# EAGLE design BMS Test Board rev1 (EAGLE 9.2.2)
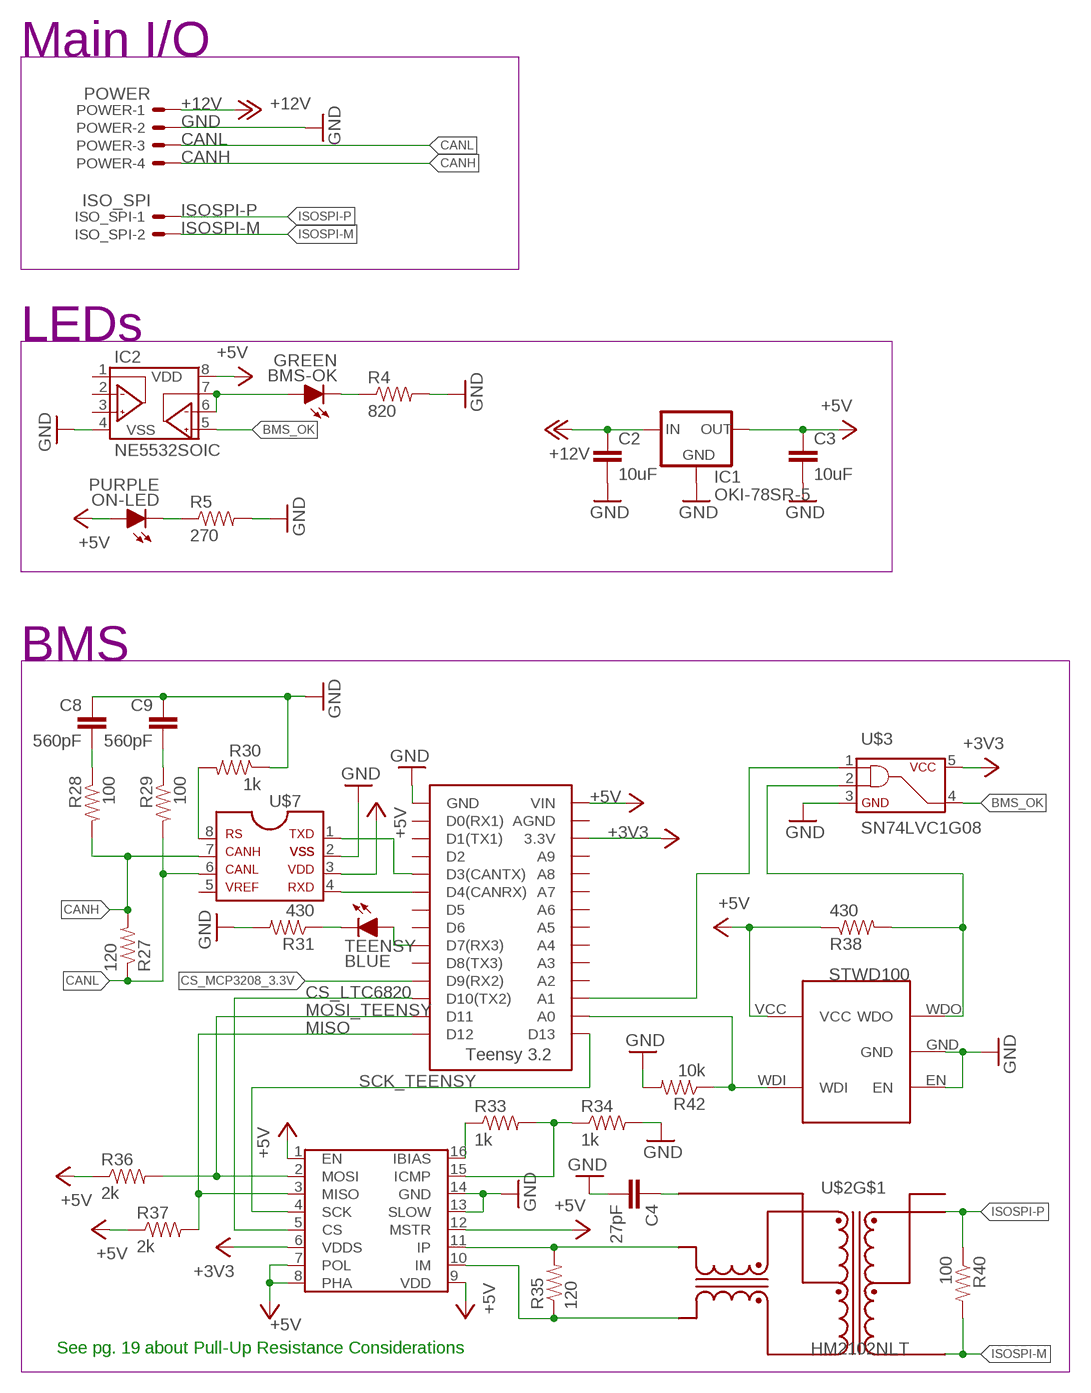
[diagram p0: schematic, sheet 1]

## Parts
BMS-OK  GREEN  LED-0805  [LED-805]
C2  10uF  CAP0805  [0805]
C3  10uF  CAP0805  [0805]
C4  27pF  CAP0805  [0805]
C8  560pF  CAP0805  [0805]
C9  560pF  CAP0805  [0805]
IC1  OKI-78SR-5  [OKI-78SR]
IC2  NE5532SOIC  [SOIC-08]
ISO_SPI  ISO_SPI  CONNECTOR-2NANO-FIT_VERTICAL-2  [NANO-FIT_VERTICAL-2]
ON-LED  PURPLE  LED-0805  [LED-805]
POWER  POWER  CONNECTOR-4NANO-FIT-VERTICAL-4  [NANO-FIT_VERTICAL-4]
R4  820  RESISTOR0805-RES  [0805]
R5  270  RESISTOR0805-RES  [0805]
R27  120  RESISTOR0805-RES  [0805]
R28  100  RESISTOR0805-RES  [0805]
R29  100  RESISTOR0805-RES  [0805]
R30  1k  RESISTOR0805-RES  [0805]
R31  430  RESISTOR0805-RES  [0805]
R33  1k  RESISTOR0805-RES  [0805]
R34  1k  RESISTOR0805-RES  [0805]
R35  120  RESISTOR0805-RES  [0805]
R36  2k  RESISTOR0805-RES  [0805]
R37  2k  RESISTOR0805-RES  [0805]
R38  430  RESISTOR0805-RES  [0805]
R40  100  RESISTOR0805-RES  [0805]
R42  10k  RESISTOR0805-RES  [0805]
TEENSY  BLUE  LED-0805  [LED-805]
U$2  HM2102NLT  [HM2102NLT]
U$3  SN74LVC1G08  [SOT-23-5]
U$7  MCP2551  [SOIC-08]
U$8  LTC6820  [MSOP-16]
U$9  TEENSY_3.2_SIMPLE  [TEENSY_3.2_SIMPLE]
U$10  STWD100  [SOT23-5]

## Nets
+3V3: U$3.5 U$8.6(VDDS) U$9.3.3V
+5V: C3.1 IC1.3(OUT) IC2.8(VDD) ON-LED.A R36.1 R37.1 R38.1 U$7.3 U$8.1(EN) U$8.7(POL) U$8.8(PHA) U$8.9(VDD) U$8.12(MSTR) U$9.VIN U$10.VCC
+12V: C2.1 IC1.1(IN) POWER.P$1
BMS_OK: IC2.5(VINB+) U$3.4
CANH: POWER.P$4 R27.2 R28.2 U$7.7
CANL: POWER.P$3 R27.1 R29.2 U$7.6
CS_LTC6820: U$8.5(CS) U$9.D10(TX2)
CS_MCP3208_3.3V: U$9.D9(RX2)
GND: C2.2 C3.2 C4.2 C8.1 C9.1 IC1.2(GND) IC2.4(VSS) POWER.P$2 R4.2 R5.2 R30.1 R31.2 R34.2 R42.2 U$3.3 U$7.2 U$8.13(SLOW) U$8.14(GND) U$9.GND U$10.EN U$10.GND
IM: R35.1 U$2.P$10(TD-) U$8.10(IM)
IP: R35.2 U$2.P$12(TD+) U$8.11(IP)
ISOSPI-M [ISO_SPI]: ISO_SPI.P$2 R40.2 U$2.P$3(MX-)
ISOSPI-P [ISO_SPI]: ISO_SPI.P$1 R40.1 U$2.P$1(MX+)
MISO: R37.2 U$8.3(MISO) U$9.D12
MOSI_TEENSY: R36.2 U$8.2(MOSI) U$9.D11
N$3: ON-LED.C R5.1
N$25: U$7.1 U$9.D3(CANTX)
N$26: R30.2 U$7.8
N$27: C8.2 R28.1
N$28: C9.2 R29.1
N$29: R31.1 TEENSY.C
N$31: R33.1 U$8.16(IBIAS)
N$32: R33.2 R34.1 U$8.15(ICMP)
N$35: C4.1 U$2.P$11(TCT)
N$36: U$7.4 U$9.D4(CANRX)
N$37: TEENSY.A U$9.D7(RX3)
N$38: R38.2 U$3.2 U$10.WDO
N$40: U$3.1 U$9.A1
N$43: BMS-OK.A IC2.6(VINB-) IC2.7(VOUTB)
N$44: BMS-OK.C R4.1
N$50: R42.1 U$9.A0 U$10.WDI
SCK_TEENSY: U$8.4(SCK) U$9.D13
Unconnected: IC2.1(VOUTA) IC2.2(VINA-) IC2.3(VINA+) U$2.P$2(MCT) U$2.P$4(MX+) U$2.P$5(MCT) U$2.P$6(MX-) U$2.P$7(TD-) U$2.P$8(TCT) U$2.P$9(TD+) U$7.5 U$9.A2 U$9.A3 U$9.A4 U$9.A5 U$9.A6 U$9.A7 U$9.A8 U$9.A9 U$9.AGND U$9.D0(RX1) U$9.D1(TX1) U$9.D2 U$9.D5 U$9.D6 U$9.D8(TX3)

## Notes on the sheet
- Main I/O
- LEDs
- BMS
- See pg. 19 about Pull-Up Resistance Considerations

## Library data of the parts
BMS-OK ON-LED TEENSY = HyTechDevices:LED: Light Emitting Diode (LED) Source: Dangerous Prototypes Eagle Library <https://github.com/DangerousPrototypes/Eagle_Part_Library>
C2-C4 C8 C9 = HyTechDevices:CAP: Capacitor Standard 0603 ceramic capacitor, and 0.1" leaded capacitor.
IC1 = HyTechDevices:OKI-78SR-5: Murata OKI-78SR 5V 1.5A Non-Isolated Switching Regulator DC/DC - Datasheet <https://power.murata.com/data/power/oki-78sr.pdf>
IC2 = HyTechDevices:NE5532: TI NE5532 Dual Channel Op Amp
ISO_SPI = HyTechDevices:CONNECTOR-2: Mini-Fit Junior connector 2 pole Source: http://www.molex.com
POWER = HyTechDevices:CONNECTOR-4: Mini-Fit Junior connector 4 pole Source: http://www.molex.com
R4 R5 R27-R31 R33-R38 R40 R42 = HyTechDevices:RESISTOR: Resistor Basic schematic elements and footprints for 0603, 1206, and PTH resistors.
U$2 = HyTechDevices:HM2102NLT: 2 Channel SMT Transformer Turns ratio: 1CT: 1CT Isolation Voltage: 4300 VDC Inductance: 150 uH Leakage Inductance: 0.50 uH max DataSheet <https://www.mouser.com/datasheet/2/336/HM2102NL-1218600.pdf>
U$3 = HyTechDevices:SN74LVC1G08: TI SN74LVC1G08 SINGLE 2-INPUT POSITIVE-AND GATE Datasheet <http://www.ti.com/lit/ds/sces556f/sces556f.pdf>
U$7 = HyTechDevices:MCP2551: MCP2551 High-Speed CAN Transceiver Product Webpage <https://www.microchip.com/wwwproducts/en/MCP2551> Datasheet <http://ww1.microchip.com/downloads/en/DeviceDoc/21667f.pdf> This device is outdated It is replaced by MCP2561. Comparison Page <https://www.microchip.com/wwwproducts/ProductCompare/MCP2551/MCP2561> Product Webpage <https://www.microchip.com/wwwproducts/en/MCP2561> Datasheet <http://ww1.microchip.com/downloads/en/DeviceDoc/20005167C.pdf>
U$8 = HyTechDevices:LTC6820: Linear Technology isoSPI Isolated Communications Interface Datasheet <http://cds.linear.com/docs/en/datasheet/6820fb.pdf>
U$9 = HyTechDevices:TEENSY_3.2_SIMPLE: Simple version of the Teensy 3.2 board that only uses the 2 main rows of pins, not the inner pins or the pins opposite the usb port.
U$10 = HyTechDevices:STWD100: STWD100 Watchdog timer

## Net classes
1 TS: clearance 8.5 mm to class 0
2 ISO_SPI: clearance 8.5 mm to class 0, clearance 8.5 mm to class 1

## Board
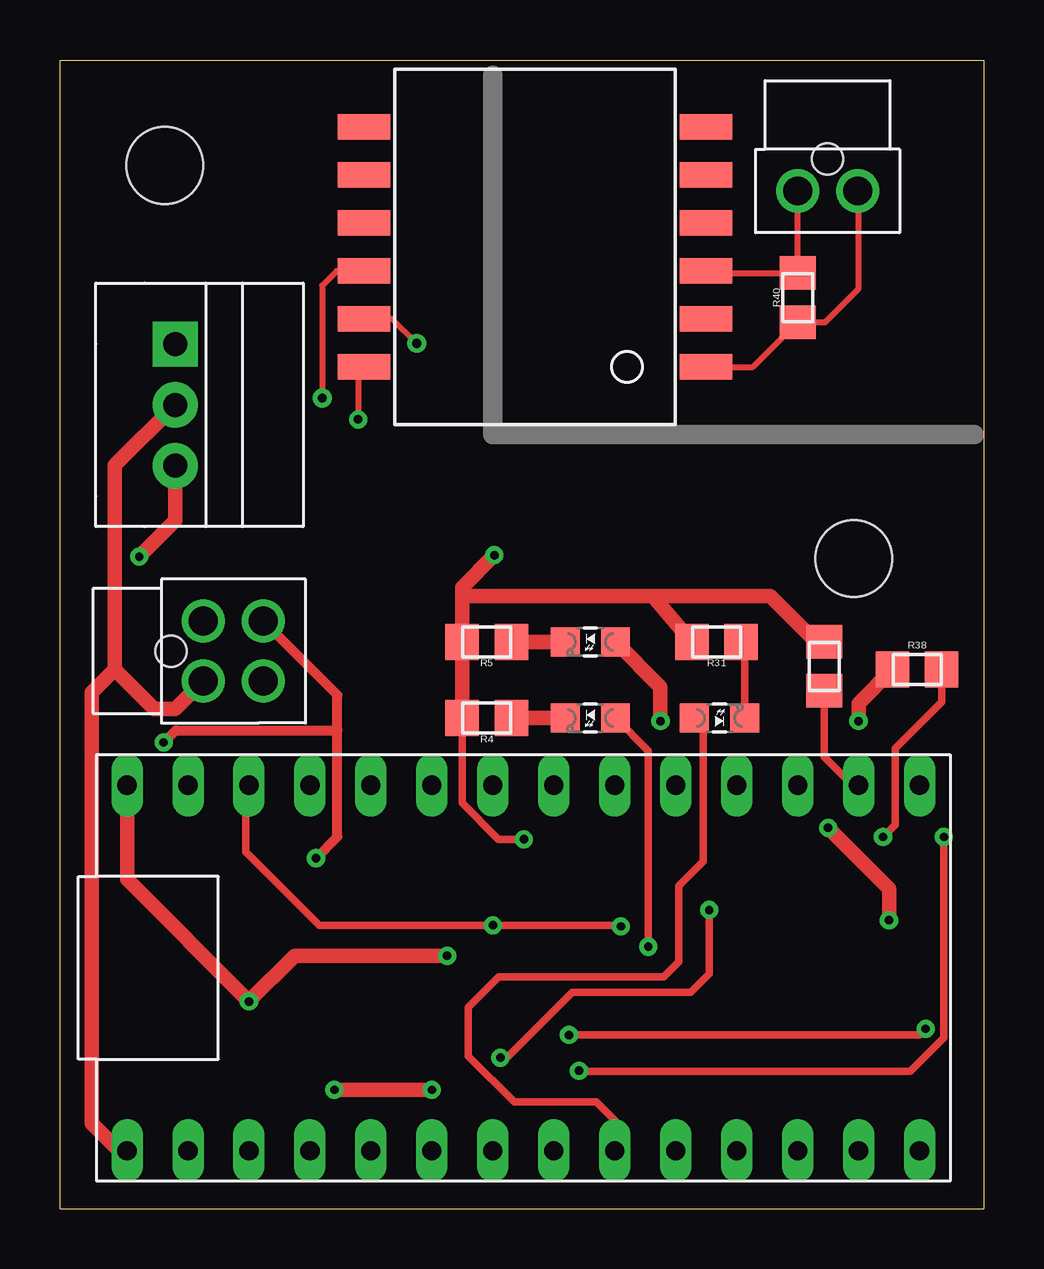
[diagram p1: board, top side]
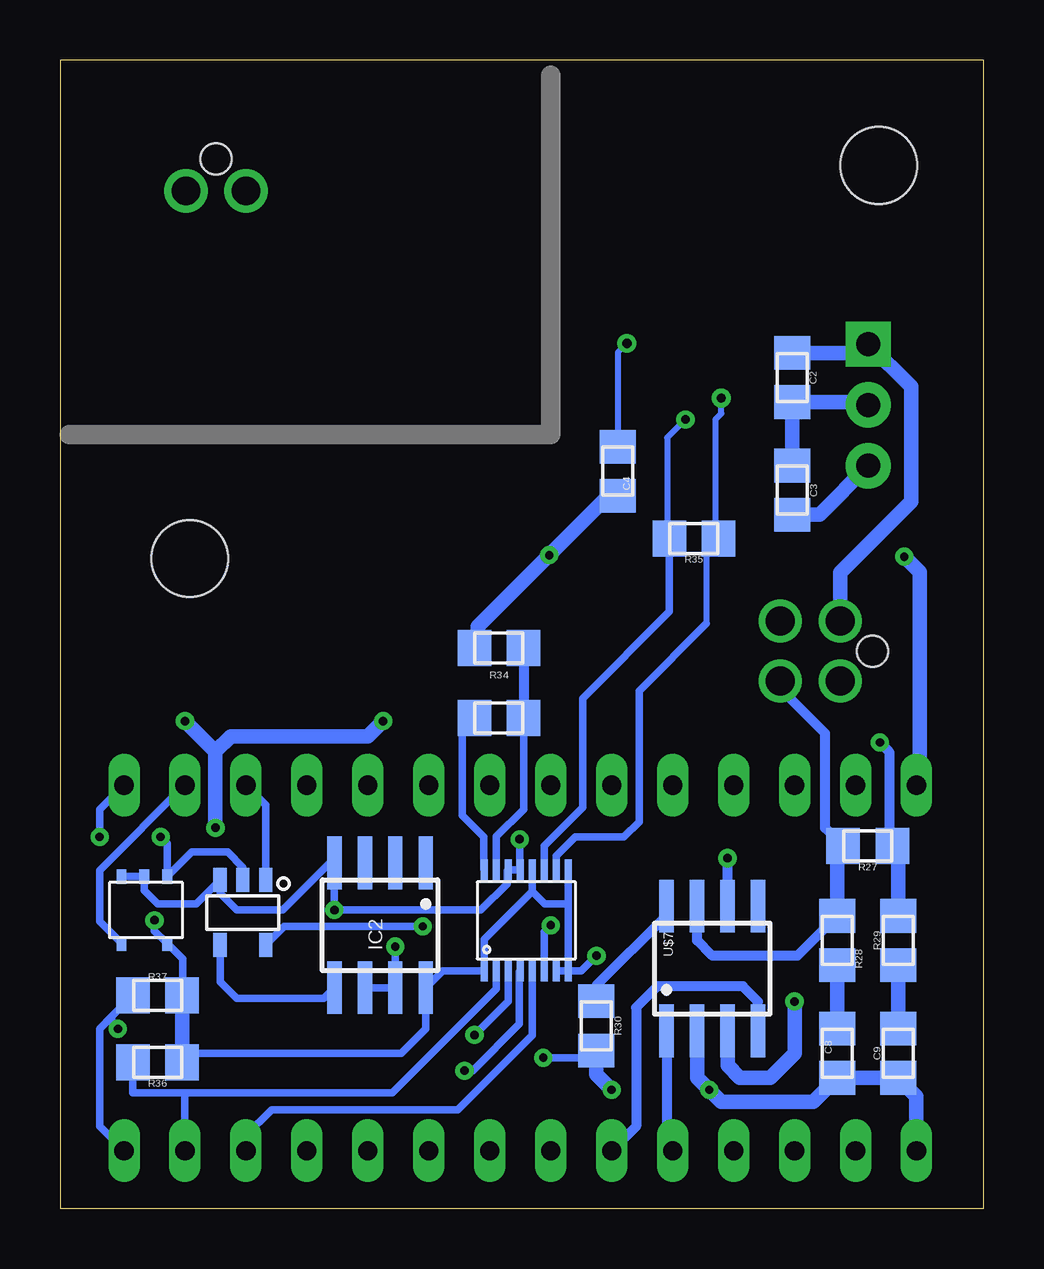
[diagram p2: board, bottom side, seen from below]

Size 38.48 x 47.88 mm. Coordinates in mm from the lower left corner, seen from the top.
Outline: 0,0 38.48,0 38.48,47.88 0,47.88 0,0
Copper layers (1*16): Top 0.035mm / dielectric 1.5mm / Bottom 0.035mm
Design rules "DRC Advanced Circuits": minimum track width 6mil, minimum drill 10mil, track to track 6mil, track to pad 6mil, pad to pad 6mil, via to via 6mil, smd to smd 6mil, copper to edge 40mil, drill to drill 6mil, minimum pad ring 10mil, minimum via ring 8mil, stop-mask expansion 4mil, vias tented up to drill 0mil, thermal gap 10mil
Holes 3.2 mm at 33.07,27.1 4.37,43.48

### Footprints (pad centres in the part's own frame; a part is rotated, then mirrored left to right if it is on the bottom)
LED-805 = smd 1.2 x 1.2: A 0,-1.05; C 0,1.05
0805 = smd 1.4 x 1.5: 1 -1.025,0; 2 1.025,0
OKI-78SR = drill 1 pad 1.88 square: 1 -2.54,0 | drill 1 pad 1.88: 2 0,0; 3 2.54,0
SOIC-08 = smd 0.6 x 2.2: 1 -1.905,-2.6; 2 -0.635,-2.6; 3 0.635,-2.6; 4 1.905,-2.6; 5 1.905,2.6; 6 0.635,2.6; 7 -0.635,2.6; 8 -1.905,2.6
NANO-FIT_VERTICAL-2 = drill 1.2: P$1 -1.25,0; P$2 1.25,0 | hole 1.3: 0,-1.34
NANO-FIT_VERTICAL-4 = drill 1.2: P$1 -1.25,0; P$2 1.25,0; P$3 -1.25,2.5; P$4 1.25,2.5 | hole 1.3: 0,-1.34
HM2102NLT = smd 1.067 x 2.184: P$1 0,0; P$2 2,0; P$3 4,0; P$4 6,0; P$5 8,0; P$6 10,0; P$7 10,14.25; P$8 8,14.25; P$9 6,14.25; P$10 4,14.25; P$11 2,14.25; P$12 0,14.25
SOT-23-5 = smd 1 x 0.55: 1 -1.35,0.95; 2 -1.35,0; 3 -1.35,-0.95; 4 1.35,-0.95; 5 1.35,0.95
MSOP-16 = smd 0.305 x 0.889: 1 -0.1,-0.5; 2 0.4,-0.5; 3 0.9,-0.5; 4 1.4,-0.5; 5 1.9,-0.5; 6 2.4,-0.5; 7 2.9,-0.5; 8 3.4,-0.5; 9 3.4,3.7; 10 2.9,3.7; 11 2.4,3.7; 12 1.9,3.7; 13 1.4,3.7; 14 0.9,3.7; 15 0.4,3.7; 16 -0.1,3.7
TEENSY_3.2_SIMPLE = drill 0.8 long: 3.3V 16.51,29.21; A0 16.51,3.81; A1 16.51,6.35; A2 16.51,8.89; A3 16.51,11.43; A4 16.51,13.97; A5 16.51,16.51; A6 16.51,19.05; A7 16.51,21.59; A8 16.51,24.13; A9 16.51,26.67; AGND 16.51,31.75; D0(RX1) 1.27,31.75; D1(TX1) 1.27,29.21; D2 1.27,26.67; D3(CANTX) 1.27,24.13; D4(CANRX) 1.27,21.59; D5 1.27,19.05; D6 1.27,16.51; D7(RX3) 1.27,13.97; D8(TX3) 1.27,11.43; D9(RX2) 1.27,8.89; D10(TX2) 1.27,6.35; D11 1.27,3.81; D12 1.27,1.27; D13 16.51,1.27; GND 1.27,34.29; VIN 16.51,34.29
SOT23-5 = smd 0.61 x 0.406: EN -2.794,0; GND -2.794,0.94; VCC 0,1.905; WDI 0,0; WDO -2.794,1.905

### Placement (x,y rotation side)
BMS-OK  22.1,20.45 90 top
C2  7.98,34.65 270 bottom
C3  7.98,29.95 90 bottom
C4  15.24,30.73 270 bottom
C8  6.1,6.48 90 bottom
C9  3.56,6.48 90 bottom
IC1  4.8,33.5 270 top
IC2  25.15,11.81 180 bottom
ISO_SPI  31.98,42.42 180 top
ON-LED  22.1,23.62 90 top
POWER  5.97,23.24 270 top
R4  17.78,20.45 180 top
R5  17.78,23.62 180 top
R27  4.83,15.11 180 bottom
R28  6.1,11.18 90 bottom
R29  3.56,11.18 90 bottom
R30  16.13,7.62 90 bottom
R31  27.36,23.62 180 top
R33  20.19,20.45 0 bottom
R34  20.19,23.37 180 bottom
R35  12.06,27.94 180 bottom
R36  34.42,6.1 180 bottom
R37  34.42,8.89 180 bottom
R38  35.71,22.48 0 top
R40  30.73,37.97 90 top
R42  31.85,22.61 90 top
TEENSY  27.48,20.45 270 top
U$2  26.92,35.09 90 top
U$3  30.86,12.34 270 bottom
U$7  11.3,10.01 0 bottom
U$8  20.7,10.41 0 bottom
U$9  37.08,1.14 90 top
U$10  35.92,11.05 270 bottom

### Tracks (layer width: path | path; a pad name or v marks a point on that pad's centre or on a via)
+3V3  (via drill 0.35)
  Top 0.305: U$9.3.3V 7.75,17.53 7.75,14.86 10.79,11.81 v18.03,11.81 23.32,11.81 v23.37,11.76
  Bottom 0.305: U$8.6 18.3,11.54 v18.03,11.81 | U$3.5 29.34,11.56 29.22,11.68 29.14,11.76 v23.37,11.76
+5V  (via drill 0.35)
  Top 0.61: v3.3,27.18 4.8,28.68 IC1.3 | U$9.VIN 2.79,13.72 v7.87,8.64 9.78,10.54 v16.13,10.54 | v25.02,20.32 25.02,21.75 ON-LED.A | R38.1 33.27,21.07 v33.27,20.32 | v32,15.87 34.54,13.33 v34.54,12.02
  Bottom 0.305: v16.13,10.54 16.76,9.91 U$8.8 17.4,9.91 | U$8.7 17.4,9.91 | U$8.9 17.3,12.7 | 17.3,12.7 17.3,10.01 17.4,9.91 | U$8.12 18.8,13.21 | 17.3,12.7 18.29,12.7 18.8,13.21 | 18.8,13.21 20.8,11.21 U$8.1 22.54,9.91 IC2.8 23.24,7.49 24.26,6.48 33.01,6.48 R36.1 | R37.1 33.38,8.91 33.38,10.41 U$10.VCC 34.54,11.58 v34.54,12.02
  Bottom 0.61: C3.1 6.83,28.92 6.83,28.93 IC1.3 | U$9.VIN 2.66,17.79 2.66,26.53 v3.3,27.18 | v7.87,8.64 7.87,6.48 8.89,5.46 10.16,5.46 10.67,5.97 U$7.3 | R37.1 R36.1 | v25.02,20.32 25.65,19.69 31.37,19.69 32,19.05 | 32,19.05 v32,15.87 | v33.27,20.32 32,19.05
+12V
  Bottom 0.61: C2.1 5.17,35.67 IC1.1 3.02,34.27 3.02,29.46 5.97,26.52 POWER.P$1
BMS_OK
  Bottom 0.305: U$3.4 31.81,9.46 31.11,8.76 27.5,8.76 IC2.5
CANH
  Bottom 0.406: R28.2 7.76,10.54 11.3,10.54 11.94,11.18 U$7.7 | R27.2 6.6,15.87 6.6,19.81 8.47,21.68 POWER.P$4
  Bottom 0.61: R28.2 6.1,14.87 R27.2
CANL  (via drill 0.35)
  Top 0.406: v10.67,14.6 11.56,15.49 11.56,19.94 | POWER.P$3 11.56,21.4 11.56,19.94 | v4.32,19.43 4.83,19.94 11.56,19.94
  Bottom 0.406: U$7.6 v10.67,14.6 | R27.1 3.94,15.25 3.94,19.05 v4.32,19.43
  Bottom 0.61: R29.2 3.56,14.87 R27.1
CS_LTC6820
  Bottom 0.305: U$9.D10(TX2) 30.73,3.05 29.67,4.11 21.91,4.11 18.8,7.23 U$8.5
GND  (via drill 0.35)
  Top 0.305: v18.35,6.29 18.61,6.29 21.34,9.02 26.29,9.02 27.05,9.78 v27.05,12.45 | R4.2 16.75,16.9 18.26,15.39 v19.33,15.39
  Top 0.61: IC1.2 2.29,30.99 2.29,22.48 | v11.43,4.95 v15.49,4.95 | 2.29,22.48 3.94,20.83 4.81,20.83 POWER.P$2 | R4.2 R5.2 16.75,25.53 | 16.75,25.53 16.75,25.9 v18.1,27.24 | R31.2 24.7,25.53 | 24.7,25.53 16.75,25.53 | 24.7,25.53 29.59,25.53 31.49,23.63 R42.2 | 2.29,22.48 1.32,21.51 1.32,3.56 2.46,2.41 U$9.GND
  Bottom 0.305: U$10.EN U$10.GND 34.98,13.26 34.42,12.7 32.8,12.7 U$3.3 31.81,13.14 31.11,12.45 29.21,12.45 27.25,14.41 IC2.4 v27.05,12.45 20.94,12.45 19.84,13.54 19.84,14.07 U$8.14 U$8.13 19.33,14.14 v19.33,15.39 | v18.35,6.29 16.43,6.29 R30.1
  Bottom 0.61: C4.2 15.24,29.59 15.75,29.59 v18.1,27.24 21.08,24.26 21.08,23.5 R34.2 | IC1.2 4.92,33.62 C2.2 C3.2 | U$9.GND 2.79,4.69 C9.1 C8.1 7.1,4.44 10.92,4.44 v11.43,4.95 11.94,5.46 U$7.2 | v15.49,4.95 16.13,5.59 R30.1
IM  (via drill 0.38)
  Top 0.254: v10.92,33.78 10.92,38.48 11.53,39.09 U$2.P$10
  Bottom 0.254: v10.92,33.78 10.92,33.15 11.18,32.89 11.18,28.08 R35.1 11.55,27.43 11.55,24.38
  Bottom 0.305: 11.55,24.38 14.35,21.58 14.35,16.13 14.99,15.49 17.02,15.49 17.8,14.71 U$8.10
IP  (via drill 0.35)
  Top 0.254: U$2.P$12 12.42,34.83 v12.42,32.89
  Bottom 0.254: R35.2 13.18,27.94 13.18,32.13 v12.42,32.89
  Bottom 0.305: R35.2 13.09,24.88 16.7,21.27 16.7,16.73 18.3,15.13 U$8.11
ISOSPI-M
  Top 0.254: ISO_SPI.P$2 R40.2 27.01,39 U$2.P$3
ISOSPI-P
  Top 0.254: ISO_SPI.P$1 33.27,42.38 33.27,38.34 31.88,36.95 R40.1 28.87,35.09 U$2.P$1
MISO  (via drill 0.35)
  Top 0.305: v21.21,7.24 35.81,7.24 v36.07,7.49
  Bottom 0.305: R37.2 36.33,8.01 | 36.33,8.01 36.83,7.5 36.83,3.43 U$9.D12 | U$8.3 19.8,8.65 v21.21,7.24 | v36.07,7.49 36.33,7.75 36.33,8.01
MOSI_TEENSY
  Bottom 0.305: U$8.2 20.3,9.16 24.64,4.83 33.28,4.83 | R36.2 35.44,4.83 33.28,4.83 | 33.28,4.83 33.28,2.42 U$9.D11
N$3
  Top 0.61: R5.1 ON-LED.C
N$25
  Bottom 0.406: U$7.1 13.21,2.67 U$9.D3(CANTX)
N$26
  Bottom 0.406: R30.2 16.13,9.31 13.21,12.23 U$7.8
N$27
  Bottom 0.61: R28.1 C8.2
N$28
  Bottom 0.61: R29.1 C9.2
N$29
  Top 0.305: R31.1 28.53,23.75 TEENSY.C
N$31
  Bottom 0.305: U$8.16 20.83,14.14 20.83,15.49 21.72,16.38 21.72,19.95 R33.1
N$32
  Bottom 0.305: R33.2 19.17,16.65 20.3,15.51 U$8.15
  Bottom 0.406: R34.1 R33.2
N$35  (via drill 0.38)
  Top 0.254: v14.86,36.07 13.84,37.09 U$2.P$11
  Bottom 0.254: v14.86,36.07 15.24,35.69 C4.1
N$36
  Bottom 0.406: U$7.4 9.4,8.64 10.03,9.27 13.59,9.27 14.48,8.38 14.48,3.43 U$9.D4(CANRX)
N$37
  Top 0.305: TEENSY.A 26.8,20.23 26.8,14.48 25.78,13.46 25.78,10.29 25.15,9.65 18.29,9.65 17.02,8.38 17.02,6.35 18.92,4.44 22.35,4.44 23.11,3.68 U$9.D7(RX3)
N$38  (via drill 0.35)
  Top 0.305: R38.2 36.74,21.12 34.8,19.18 34.8,16 v34.29,15.49
  Bottom 0.305: U$3.2 30.86,14.22 31.5,14.86 32.99,14.86 U$10.WDO 34.01,15.21 v34.29,15.49
N$40
  Bottom 0.305: U$3.1 29.91,16.83 U$9.A1
N$43  (via drill 0.35)
  Top 0.305: BMS-OK.A 24.51,19.08 v24.51,10.92
  Bottom 0.305: IC2.6 IC2.7 v24.51,10.92
N$44
  Top 0.61: R4.1 BMS-OK.C
N$50
  Top 0.305: R42.1 31.85,18.82 33.02,17.65 U$9.A0
  Bottom 0.305: U$9.A0 36.83,14.1 36.83,11.96 U$10.WDI
SCK_TEENSY  (via drill 0.35)
  Top 0.305: v36.83,15.49 36.83,7.11 35.43,5.71 21.66,5.71 v21.62,5.75
  Bottom 0.305: v36.83,15.49 36.83,16.64 U$9.D13 | U$8.4 19.34,9.87 19.34,7.69 21.29,5.75 v21.62,5.75

### Text on the board
tDocu: GLV | isoSPI | 2019 BMS / Test board rev1 | isoSPI | GLV
bDocu: GLV | isoSPI | isoSPI | GLV | SN74LVC1G08 | STWD100 | LTC6820
200bmp: C:/Users/yyeh8/Documents/GitHub/circuits-2019/EAGLE Supporting Files/Bitmaps for logos/HyTech_square.bmp | C:/Users/yyeh8/Documents/GitHub/circuits-2019/EAGLE Supporting Files/Bitmaps for logos/HyTech_square.bmp